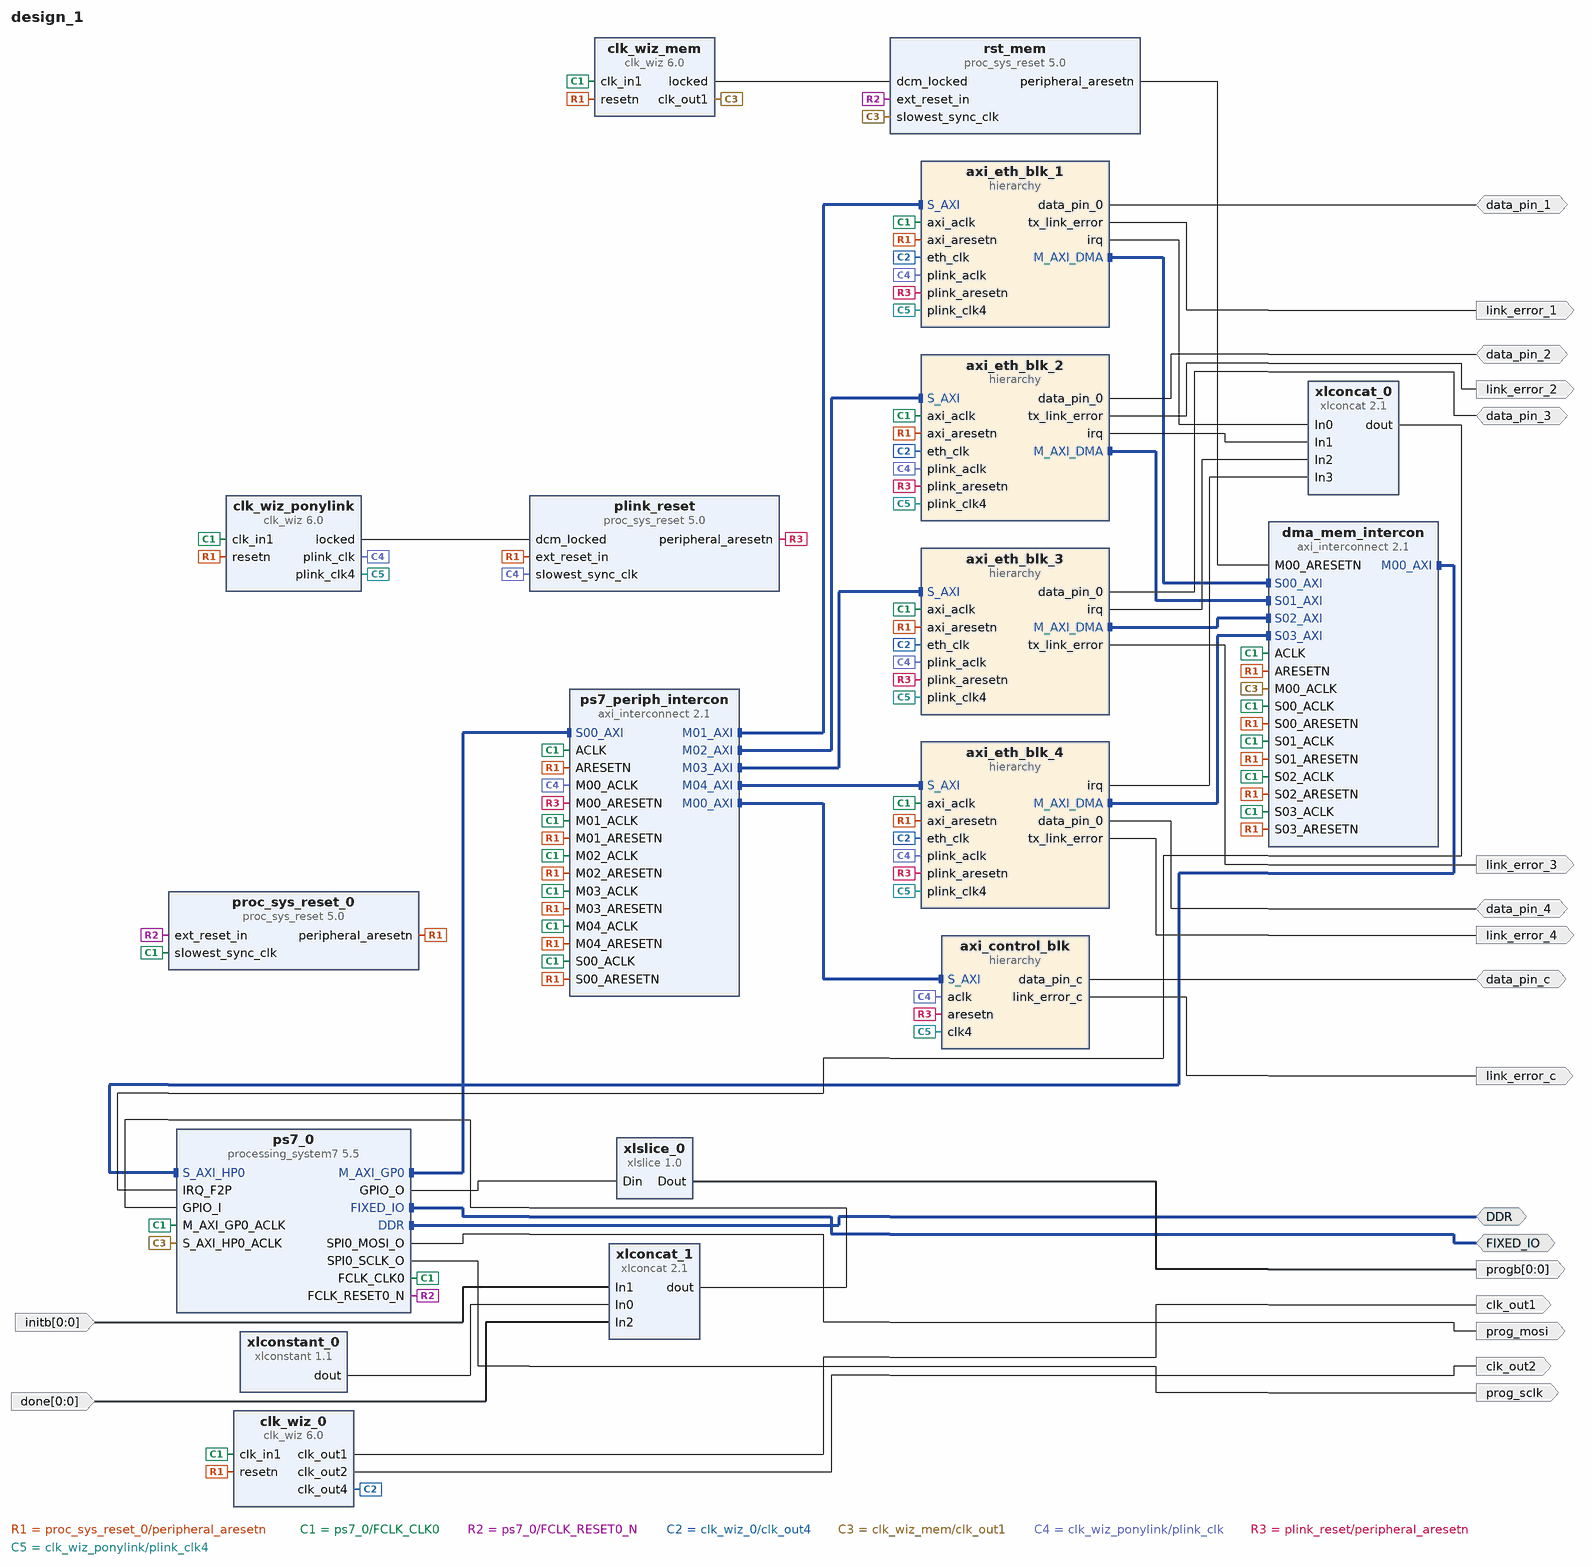
[diagram p0: block diagram of the top level]
# Vivado block design design_1, xc7z020clg484-1, Vivado 2019.2
create_bd_design design_1

create_bd_intf_port -mode Master -vlnv xilinx.com:interface:ddrx_rtl:1.0 DDR
create_bd_intf_port -mode Master -vlnv xilinx.com:display_processing_system7:fixedio_rtl:1.0 FIXED_IO
create_bd_port -dir O -type clk clk_out1
create_bd_port -dir O -type clk clk_out2
create_bd_port -dir IO data_pin_1
create_bd_port -dir O link_error_1
create_bd_port -dir IO data_pin_3
create_bd_port -dir IO data_pin_2
create_bd_port -dir O link_error_4
create_bd_port -dir O link_error_3
create_bd_port -dir O link_error_2
create_bd_port -dir IO data_pin_4
create_bd_port -dir IO data_pin_c
create_bd_port -dir O link_error_c
create_bd_port -dir O prog_mosi
create_bd_port -dir O prog_sclk
create_bd_port -dir I -from 0 -to 0 initb
create_bd_port -dir I -from 0 -to 0 done
create_bd_port -dir O -from 0 -to 0 progb

create_bd_cell -type ip -vlnv xilinx.com:ip:clk_wiz:6.0 clk_wiz_0
set_property -dict [list \
  CONFIG.AXI_DRP false \
  CONFIG.CLKIN1_JITTER_PS 200.0 \
  CONFIG.CLKOUT1_DRIVES BUFG \
  CONFIG.CLKOUT1_JITTER 192.113 \
  CONFIG.CLKOUT1_PHASE_ERROR 164.985 \
  CONFIG.CLKOUT1_REQUESTED_OUT_FREQ 50 \
  CONFIG.CLKOUT2_DRIVES BUFG \
  CONFIG.CLKOUT2_JITTER 280.027 \
  CONFIG.CLKOUT2_PHASE_ERROR 164.985 \
  CONFIG.CLKOUT2_REQUESTED_OUT_FREQ 11.0592 \
  CONFIG.CLKOUT2_USED true \
  CONFIG.CLKOUT3_DRIVES BUFG \
  CONFIG.CLKOUT3_JITTER 142.107 \
  CONFIG.CLKOUT3_PHASE_ERROR 164.985 \
  CONFIG.CLKOUT3_REQUESTED_OUT_FREQ 200 \
  CONFIG.CLKOUT3_USED true \
  CONFIG.CLKOUT4_DRIVES BUFG \
  CONFIG.CLKOUT4_REQUESTED_OUT_FREQ 125 \
  CONFIG.CLKOUT4_USED true \
  CONFIG.CLKOUT5_DRIVES BUFG \
  CONFIG.CLKOUT6_DRIVES BUFG \
  CONFIG.CLKOUT7_DRIVES BUFG \
  CONFIG.FEEDBACK_SOURCE FDBK_AUTO \
  CONFIG.MMCM_CLKFBOUT_MULT_F 20.000 \
  CONFIG.MMCM_CLKIN1_PERIOD 20.000 \
  CONFIG.MMCM_CLKIN2_PERIOD 10.0 \
  CONFIG.MMCM_CLKOUT0_DIVIDE_F 20.000 \
  CONFIG.MMCM_CLKOUT1_DIVIDE 90 \
  CONFIG.MMCM_CLKOUT2_DIVIDE 5 \
  CONFIG.MMCM_COMPENSATION ZHOLD \
  CONFIG.MMCM_DIVCLK_DIVIDE 1 \
  CONFIG.NUM_OUT_CLKS 4 \
  CONFIG.PHASE_DUTY_CONFIG false \
  CONFIG.PRIMITIVE MMCM \
  CONFIG.PRIM_SOURCE Global_buffer \
  CONFIG.RESET_PORT resetn \
  CONFIG.RESET_TYPE ACTIVE_LOW \
  CONFIG.USE_DYN_RECONFIG false \
  CONFIG.USE_LOCKED false \
  CONFIG.USE_SAFE_CLOCK_STARTUP false \
] [get_bd_cells clk_wiz_0]
create_bd_cell -type ip -vlnv xilinx.com:ip:proc_sys_reset:5.0 proc_sys_reset_0
create_bd_cell -type ip -vlnv xilinx.com:ip:processing_system7:5.5 ps7_0
set_property -dict [list \
  CONFIG.PCW_APU_PERIPHERAL_FREQMHZ 666.666666 \
  CONFIG.PCW_ENET0_ENET0_IO {MIO 16 .. 27} \
  CONFIG.PCW_ENET0_GRP_MDIO_ENABLE 1 \
  CONFIG.PCW_ENET0_GRP_MDIO_IO {MIO 52 .. 53} \
  CONFIG.PCW_ENET0_PERIPHERAL_ENABLE 1 \
  CONFIG.PCW_ENET0_RESET_ENABLE 0 \
  CONFIG.PCW_ENET_RESET_ENABLE 1 \
  CONFIG.PCW_ENET_RESET_SELECT {Share reset pin} \
  CONFIG.PCW_FPGA0_PERIPHERAL_FREQMHZ 50 \
  CONFIG.PCW_FPGA1_PERIPHERAL_FREQMHZ 100 \
  CONFIG.PCW_FPGA2_PERIPHERAL_FREQMHZ 200 \
  CONFIG.PCW_FPGA3_PERIPHERAL_FREQMHZ 10 \
  CONFIG.PCW_GP0_EN_MODIFIABLE_TXN 0 \
  CONFIG.PCW_GP1_EN_MODIFIABLE_TXN 0 \
  CONFIG.PCW_GPIO_EMIO_GPIO_ENABLE 1 \
  CONFIG.PCW_GPIO_EMIO_GPIO_IO 3 \
  CONFIG.PCW_GPIO_EMIO_GPIO_WIDTH 3 \
  CONFIG.PCW_GPIO_MIO_GPIO_ENABLE 1 \
  CONFIG.PCW_GPIO_MIO_GPIO_IO MIO \
  CONFIG.PCW_I2C_RESET_ENABLE 1 \
  CONFIG.PCW_IRQ_F2P_INTR 1 \
  CONFIG.PCW_M_AXI_GP0_FREQMHZ 50 \
  CONFIG.PCW_PERIPHERAL_BOARD_PRESET None \
  CONFIG.PCW_PRESET_BANK1_VOLTAGE {LVCMOS 2.5V} \
  CONFIG.PCW_QSPI_GRP_SINGLE_SS_ENABLE 1 \
  CONFIG.PCW_QSPI_GRP_SINGLE_SS_IO {MIO 1 .. 6} \
  CONFIG.PCW_QSPI_PERIPHERAL_ENABLE 1 \
  CONFIG.PCW_QSPI_QSPI_IO {MIO 1 .. 6} \
  CONFIG.PCW_SD0_GRP_CD_ENABLE 1 \
  CONFIG.PCW_SD0_GRP_CD_IO {MIO 48} \
  CONFIG.PCW_SD0_GRP_WP_ENABLE 0 \
  CONFIG.PCW_SD0_PERIPHERAL_ENABLE 1 \
  CONFIG.PCW_SD0_SD0_IO {MIO 40 .. 45} \
  CONFIG.PCW_SDIO_PERIPHERAL_FREQMHZ 50 \
  CONFIG.PCW_SINGLE_QSPI_DATA_MODE x4 \
  CONFIG.PCW_SPI0_PERIPHERAL_ENABLE 1 \
  CONFIG.PCW_SPI0_SPI0_IO EMIO \
  CONFIG.PCW_SPI_PERIPHERAL_FREQMHZ 166.666672 \
  CONFIG.PCW_S_AXI_HP0_FREQMHZ 100 \
  CONFIG.PCW_UART0_PERIPHERAL_ENABLE 1 \
  CONFIG.PCW_UART0_UART0_IO {MIO 46 .. 47} \
  CONFIG.PCW_UART1_PERIPHERAL_ENABLE 0 \
  CONFIG.PCW_UART_PERIPHERAL_FREQMHZ 100 \
  CONFIG.PCW_UIPARAM_DDR_BUS_WIDTH {16 Bit} \
  CONFIG.PCW_UIPARAM_DDR_FREQ_MHZ 533.333333 \
  CONFIG.PCW_UIPARAM_DDR_MEMORY_TYPE {DDR 3 (Low Voltage)} \
  CONFIG.PCW_UIPARAM_DDR_PARTNO {MT41K256M16 RE-125} \
  CONFIG.PCW_USB0_PERIPHERAL_ENABLE 1 \
  CONFIG.PCW_USB0_RESET_ENABLE 1 \
  CONFIG.PCW_USB0_RESET_IO {MIO 49} \
  CONFIG.PCW_USB0_USB0_IO {MIO 28 .. 39} \
  CONFIG.PCW_USB_RESET_ENABLE 1 \
  CONFIG.PCW_USB_RESET_SELECT {Share reset pin} \
  CONFIG.PCW_USE_FABRIC_INTERRUPT 1 \
  CONFIG.PCW_USE_S_AXI_HP0 1 \
] [get_bd_cells ps7_0]
# 509 more settings of ps7_0 are not shown: defaults, MIO pin electricals, DDR timing, and values the tool derives
create_bd_cell -type ip -vlnv xilinx.com:ip:clk_wiz:6.0 clk_wiz_mem
set_property -dict {CONFIG.RESET_PORT resetn CONFIG.RESET_TYPE ACTIVE_LOW} [get_bd_cells clk_wiz_mem]
create_bd_cell -type ip -vlnv xilinx.com:ip:proc_sys_reset:5.0 rst_mem
create_bd_cell -type hier axi_eth_blk_1
create_bd_cell -type ip -vlnv xilinx.com:ip:clk_wiz:6.0 clk_wiz_ponylink
set_property -dict [list \
  CONFIG.CLKOUT1_JITTER 236.428 \
  CONFIG.CLKOUT1_PHASE_ERROR 164.985 \
  CONFIG.CLKOUT1_REQUESTED_OUT_FREQ 25 \
  CONFIG.CLKOUT2_JITTER 162.035 \
  CONFIG.CLKOUT2_PHASE_ERROR 164.985 \
  CONFIG.CLKOUT2_REQUESTED_OUT_FREQ 100 \
  CONFIG.CLKOUT2_USED true \
  CONFIG.CLK_OUT1_PORT plink_clk \
  CONFIG.CLK_OUT2_PORT plink_clk4 \
  CONFIG.MMCM_CLKFBOUT_MULT_F 20.000 \
  CONFIG.MMCM_CLKOUT0_DIVIDE_F 40.000 \
  CONFIG.MMCM_CLKOUT1_DIVIDE 10 \
  CONFIG.NUM_OUT_CLKS 2 \
  CONFIG.RESET_PORT resetn \
  CONFIG.RESET_TYPE ACTIVE_LOW \
] [get_bd_cells clk_wiz_ponylink]
create_bd_cell -type ip -vlnv xilinx.com:ip:proc_sys_reset:5.0 plink_reset
create_bd_cell -type ip -vlnv xilinx.com:ip:xlconcat:2.1 xlconcat_0
set_property -dict [list \
  CONFIG.IN0_WIDTH 4 \
  CONFIG.IN1_WIDTH 4 \
  CONFIG.IN2_WIDTH 4 \
  CONFIG.IN3_WIDTH 4 \
  CONFIG.NUM_PORTS 4 \
] [get_bd_cells xlconcat_0]
create_bd_cell -type hier axi_control_blk
create_bd_cell -type ip -vlnv xilinx.com:ip:xlslice:1.0 xlslice_0
set_property -dict {CONFIG.DIN_WIDTH 3} [get_bd_cells xlslice_0]
create_bd_cell -type ip -vlnv xilinx.com:ip:xlconstant:1.1 xlconstant_0
set_property -dict {CONFIG.CONST_VAL 0} [get_bd_cells xlconstant_0]
create_bd_cell -type ip -vlnv xilinx.com:ip:xlconcat:2.1 xlconcat_1
set_property -dict {CONFIG.NUM_PORTS 3} [get_bd_cells xlconcat_1]
create_bd_cell -type ip -vlnv xilinx.com:ip:axi_interconnect:2.1 ps7_periph_intercon
set_property -dict {CONFIG.NUM_MI 5} [get_bd_cells ps7_periph_intercon]
create_bd_cell -type ip -vlnv xilinx.com:ip:axi_interconnect:2.1 dma_mem_intercon
set_property -dict {CONFIG.NUM_MI 1 CONFIG.NUM_SI 4} [get_bd_cells dma_mem_intercon]
create_bd_cell -type hier axi_eth_blk_2
create_bd_cell -type hier axi_eth_blk_3
create_bd_cell -type hier axi_eth_blk_4

# ---- hierarchy /axi_eth_blk_1 ----
current_bd_instance /axi_eth_blk_1
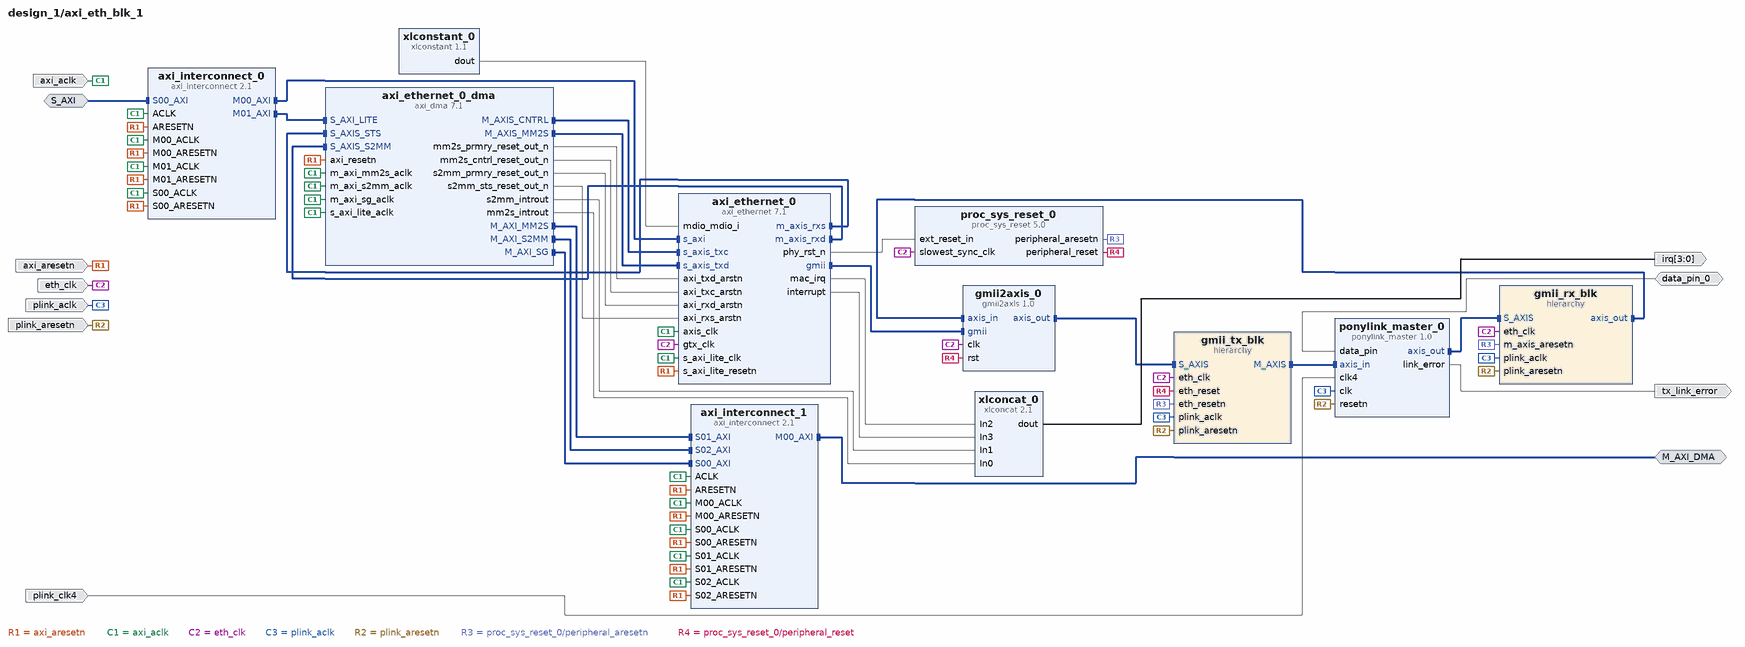
[diagram p1: block diagram inside /axi_eth_blk_1]
create_bd_intf_pin -mode Slave -vlnv xilinx.com:interface:aximm_rtl:1.0 S_AXI
create_bd_intf_pin -mode Master -vlnv xilinx.com:interface:aximm_rtl:1.0 M_AXI_DMA
create_bd_pin -dir I -type rst axi_aresetn
create_bd_pin -dir I -type clk axi_aclk
create_bd_pin -dir I -type clk eth_clk
create_bd_pin -dir O -from 3 -to 0 irq
create_bd_pin -dir I -type clk plink_aclk
create_bd_pin -dir I -type rst plink_aresetn
create_bd_pin -dir I -type clk plink_clk4
create_bd_pin -dir IO data_pin_0
create_bd_pin -dir O tx_link_error

create_bd_cell -type ip -vlnv xilinx.com:ip:axi_ethernet:7.1 axi_ethernet_0
set_property -dict {CONFIG.Include_IO false} [get_bd_cells axi_ethernet_0]
create_bd_cell -type ip -vlnv xilinx.com:ip:axi_dma:7.1 axi_ethernet_0_dma
set_property -dict [list \
  CONFIG.c_include_mm2s_dre 1 \
  CONFIG.c_include_s2mm_dre 1 \
  CONFIG.c_sg_length_width 16 \
  CONFIG.c_sg_use_stsapp_length 1 \
] [get_bd_cells axi_ethernet_0_dma]
create_bd_cell -type ip -vlnv xilinx.com:ip:xlconcat:2.1 xlconcat_0
set_property -dict {CONFIG.NUM_PORTS 4} [get_bd_cells xlconcat_0]
create_bd_cell -type hier gmii_tx_blk
create_bd_cell -type ip -vlnv xilinx.com:ip:proc_sys_reset:5.0 proc_sys_reset_0
create_bd_cell -type ip -vlnv clifford.at:cliffordwolf:ponylink_master:1.0 ponylink_master_0
set_property -dict [list \
  CONFIG.MASTER_TIMINGS 0x09070503010907050301 \
  CONFIG.SLAVE_TIMINGS 0x0d0a0705020b09060301 \
  CONFIG.TDATA_WIDTH 8 \
] [get_bd_cells ponylink_master_0]
create_bd_cell -type ip -vlnv xilinx.com:ip:xlconstant:1.1 xlconstant_0
create_bd_cell -type ip -vlnv xilinx.com:ip:axi_interconnect:2.1 axi_interconnect_0
set_property -dict {CONFIG.NUM_MI 2} [get_bd_cells axi_interconnect_0]
create_bd_cell -type ip -vlnv xilinx.com:ip:axi_interconnect:2.1 axi_interconnect_1
set_property -dict {CONFIG.NUM_MI 1 CONFIG.NUM_SI 3} [get_bd_cells axi_interconnect_1]
create_bd_cell -type hier gmii_rx_blk
create_bd_cell -type ip -vlnv user.org:user:gmii2axis:1.0 gmii2axis_0

# ---- hierarchy /axi_eth_blk_1/gmii_tx_blk ----
current_bd_instance /axi_eth_blk_1/gmii_tx_blk
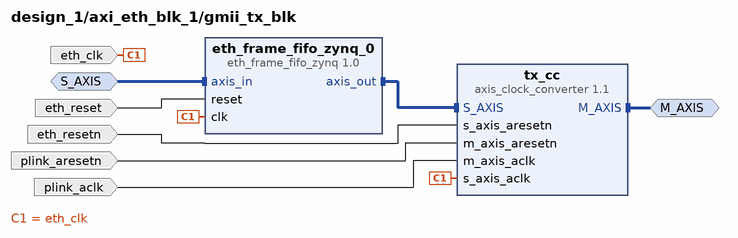
[diagram p2: block diagram inside /axi_eth_blk_1/gmii_tx_blk]
create_bd_intf_pin -mode Slave -vlnv xilinx.com:interface:axis_rtl:1.0 S_AXIS
create_bd_intf_pin -mode Master -vlnv xilinx.com:interface:axis_rtl:1.0 M_AXIS
create_bd_pin -dir I -type clk eth_clk
create_bd_pin -dir I -type rst eth_reset
create_bd_pin -dir I -type rst eth_resetn
create_bd_pin -dir I -type rst plink_aresetn
create_bd_pin -dir I -type clk plink_aclk

create_bd_cell -type ip -vlnv xilinx.com:ip:axis_clock_converter:1.1 tx_cc
create_bd_cell -type ip -vlnv user.org:user:eth_frame_fifo_zynq:1.0 eth_frame_fifo_zynq_0
set_property -dict {CONFIG.DEPTH 16384} [get_bd_cells eth_frame_fifo_zynq_0]

# ---- hierarchy /axi_eth_blk_1/gmii_rx_blk ----
current_bd_instance /axi_eth_blk_1/gmii_rx_blk
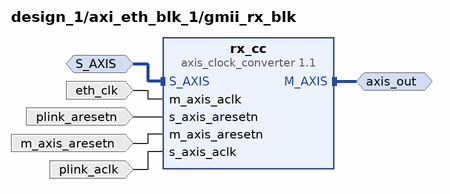
[diagram p3: block diagram inside /axi_eth_blk_1/gmii_rx_blk]
create_bd_intf_pin -mode Master -vlnv xilinx.com:interface:axis_rtl:1.0 axis_out
create_bd_intf_pin -mode Slave -vlnv xilinx.com:interface:axis_rtl:1.0 S_AXIS
create_bd_pin -dir I -type clk eth_clk
create_bd_pin -dir I -type rst plink_aresetn
create_bd_pin -dir I -type rst m_axis_aresetn
create_bd_pin -dir I -type clk plink_aclk

create_bd_cell -type ip -vlnv xilinx.com:ip:axis_clock_converter:1.1 rx_cc

# ---- hierarchy /axi_control_blk ----
current_bd_instance /axi_control_blk
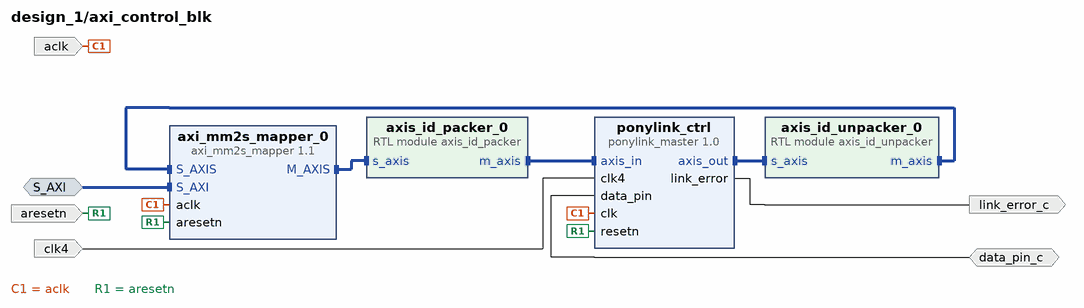
[diagram p4: block diagram inside /axi_control_blk]
create_bd_intf_pin -mode Slave -vlnv xilinx.com:interface:aximm_rtl:1.0 S_AXI
create_bd_pin -dir I -type clk aclk
create_bd_pin -dir I -type clk clk4
create_bd_pin -dir I -type rst aresetn
create_bd_pin -dir O link_error_c
create_bd_pin -dir IO data_pin_c

create_bd_cell -type ip -vlnv clifford.at:cliffordwolf:ponylink_master:1.0 ponylink_ctrl
set_property -dict [list \
  CONFIG.MASTER_TIMINGS 0x09070503010907050301 \
  CONFIG.SLAVE_TIMINGS 0x0d0a0705020b09060301 \
  CONFIG.TDATA_WIDTH 8 \
  CONFIG.TUSER_WIDTH 4 \
] [get_bd_cells ponylink_ctrl]
create_bd_cell -type module -reference axis_id_packer axis_id_packer_0
set_property -dict {CONFIG.TID_WIDTH 3 CONFIG.TUSER_WIDTH 4} [get_bd_cells axis_id_packer_0]
create_bd_cell -type module -reference axis_id_unpacker axis_id_unpacker_0
set_property -dict {CONFIG.TID_WIDTH 3 CONFIG.TUSER_WIDTH 4} [get_bd_cells axis_id_unpacker_0]
create_bd_cell -type ip -vlnv xilinx.com:ip:axi_mm2s_mapper:1.1 axi_mm2s_mapper_0
set_property -dict {CONFIG.ID_WIDTH 12 CONFIG.INTERFACES S_AXI} [get_bd_cells axi_mm2s_mapper_0]

# ---- hierarchy /axi_eth_blk_2 ----
current_bd_instance /axi_eth_blk_2
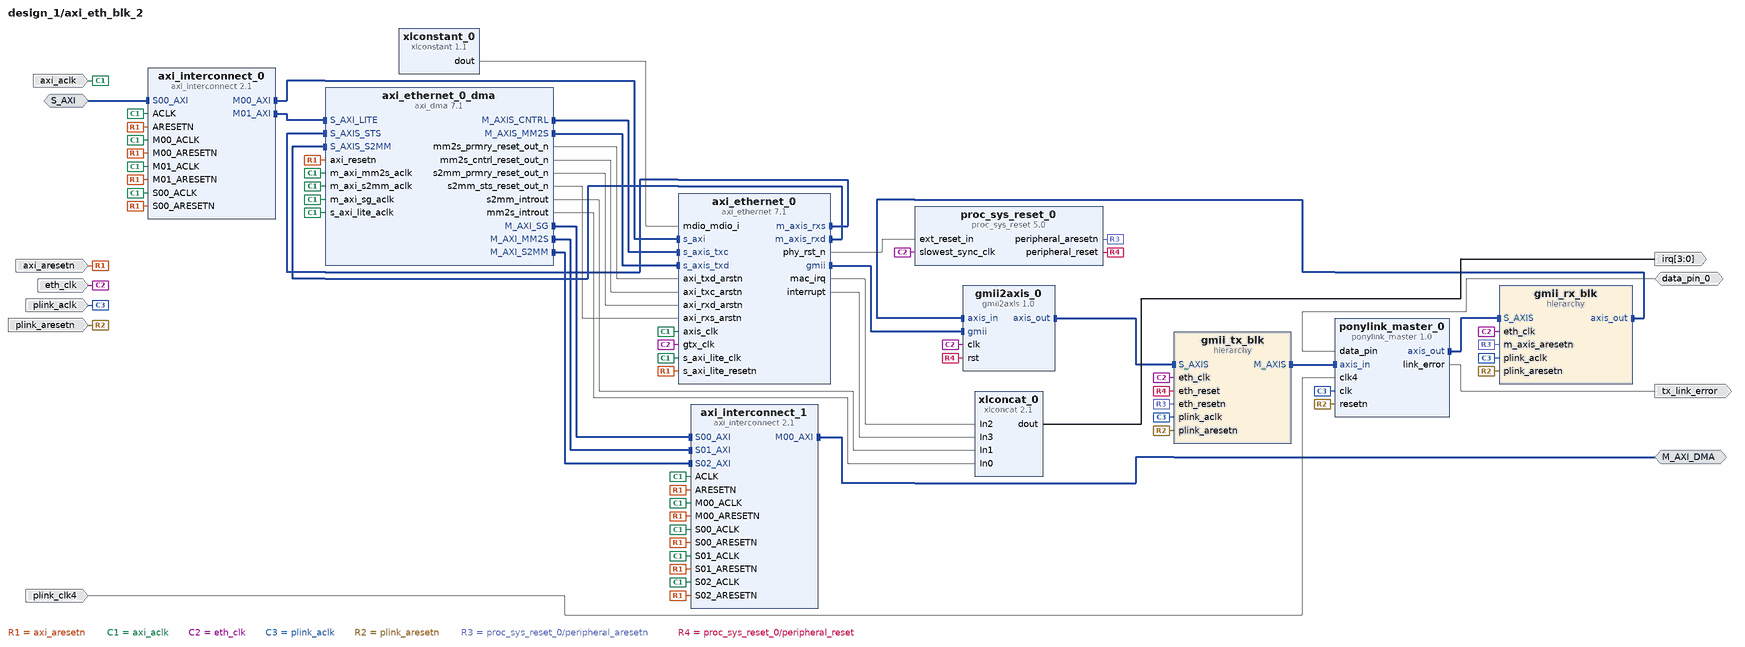
[diagram p5: block diagram inside /axi_eth_blk_2]
create_bd_intf_pin -mode Slave -vlnv xilinx.com:interface:aximm_rtl:1.0 S_AXI
create_bd_intf_pin -mode Master -vlnv xilinx.com:interface:aximm_rtl:1.0 M_AXI_DMA
create_bd_pin -dir I -type rst axi_aresetn
create_bd_pin -dir I -type clk axi_aclk
create_bd_pin -dir I -type clk eth_clk
create_bd_pin -dir O -from 3 -to 0 irq
create_bd_pin -dir I -type clk plink_aclk
create_bd_pin -dir I -type rst plink_aresetn
create_bd_pin -dir I -type clk plink_clk4
create_bd_pin -dir IO data_pin_0
create_bd_pin -dir O tx_link_error

create_bd_cell -type ip -vlnv xilinx.com:ip:axi_ethernet:7.1 axi_ethernet_0
set_property -dict {CONFIG.Include_IO false} [get_bd_cells axi_ethernet_0]
create_bd_cell -type ip -vlnv xilinx.com:ip:axi_dma:7.1 axi_ethernet_0_dma
set_property -dict [list \
  CONFIG.c_include_mm2s_dre 1 \
  CONFIG.c_include_s2mm_dre 1 \
  CONFIG.c_sg_length_width 16 \
  CONFIG.c_sg_use_stsapp_length 1 \
] [get_bd_cells axi_ethernet_0_dma]
create_bd_cell -type ip -vlnv xilinx.com:ip:xlconcat:2.1 xlconcat_0
set_property -dict {CONFIG.NUM_PORTS 4} [get_bd_cells xlconcat_0]
create_bd_cell -type hier gmii_tx_blk
create_bd_cell -type ip -vlnv xilinx.com:ip:proc_sys_reset:5.0 proc_sys_reset_0
create_bd_cell -type ip -vlnv clifford.at:cliffordwolf:ponylink_master:1.0 ponylink_master_0
set_property -dict [list \
  CONFIG.MASTER_TIMINGS 0x09070503010907050301 \
  CONFIG.SLAVE_TIMINGS 0x0d0a0705020b09060301 \
  CONFIG.TDATA_WIDTH 8 \
] [get_bd_cells ponylink_master_0]
create_bd_cell -type ip -vlnv xilinx.com:ip:xlconstant:1.1 xlconstant_0
create_bd_cell -type ip -vlnv xilinx.com:ip:axi_interconnect:2.1 axi_interconnect_0
set_property -dict {CONFIG.NUM_MI 2} [get_bd_cells axi_interconnect_0]
create_bd_cell -type ip -vlnv xilinx.com:ip:axi_interconnect:2.1 axi_interconnect_1
set_property -dict {CONFIG.NUM_MI 1 CONFIG.NUM_SI 3} [get_bd_cells axi_interconnect_1]
create_bd_cell -type hier gmii_rx_blk
create_bd_cell -type ip -vlnv user.org:user:gmii2axis:1.0 gmii2axis_0

# ---- hierarchy /axi_eth_blk_2/gmii_tx_blk ----
current_bd_instance /axi_eth_blk_2/gmii_tx_blk
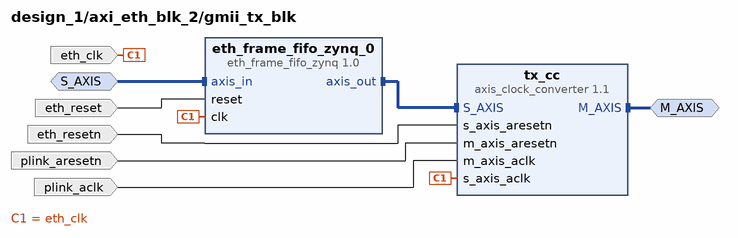
[diagram p6: block diagram inside /axi_eth_blk_2/gmii_tx_blk]
create_bd_intf_pin -mode Slave -vlnv xilinx.com:interface:axis_rtl:1.0 S_AXIS
create_bd_intf_pin -mode Master -vlnv xilinx.com:interface:axis_rtl:1.0 M_AXIS
create_bd_pin -dir I -type clk eth_clk
create_bd_pin -dir I -type rst eth_reset
create_bd_pin -dir I -type rst eth_resetn
create_bd_pin -dir I -type rst plink_aresetn
create_bd_pin -dir I -type clk plink_aclk

create_bd_cell -type ip -vlnv xilinx.com:ip:axis_clock_converter:1.1 tx_cc
create_bd_cell -type ip -vlnv user.org:user:eth_frame_fifo_zynq:1.0 eth_frame_fifo_zynq_0
set_property -dict {CONFIG.DEPTH 16384} [get_bd_cells eth_frame_fifo_zynq_0]

# ---- hierarchy /axi_eth_blk_2/gmii_rx_blk ----
current_bd_instance /axi_eth_blk_2/gmii_rx_blk
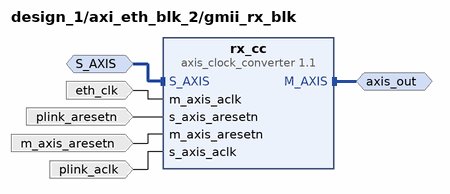
[diagram p7: block diagram inside /axi_eth_blk_2/gmii_rx_blk]
create_bd_intf_pin -mode Master -vlnv xilinx.com:interface:axis_rtl:1.0 axis_out
create_bd_intf_pin -mode Slave -vlnv xilinx.com:interface:axis_rtl:1.0 S_AXIS
create_bd_pin -dir I -type clk eth_clk
create_bd_pin -dir I -type rst plink_aresetn
create_bd_pin -dir I -type rst m_axis_aresetn
create_bd_pin -dir I -type clk plink_aclk

create_bd_cell -type ip -vlnv xilinx.com:ip:axis_clock_converter:1.1 rx_cc

# ---- hierarchy /axi_eth_blk_3 ----
current_bd_instance /axi_eth_blk_3
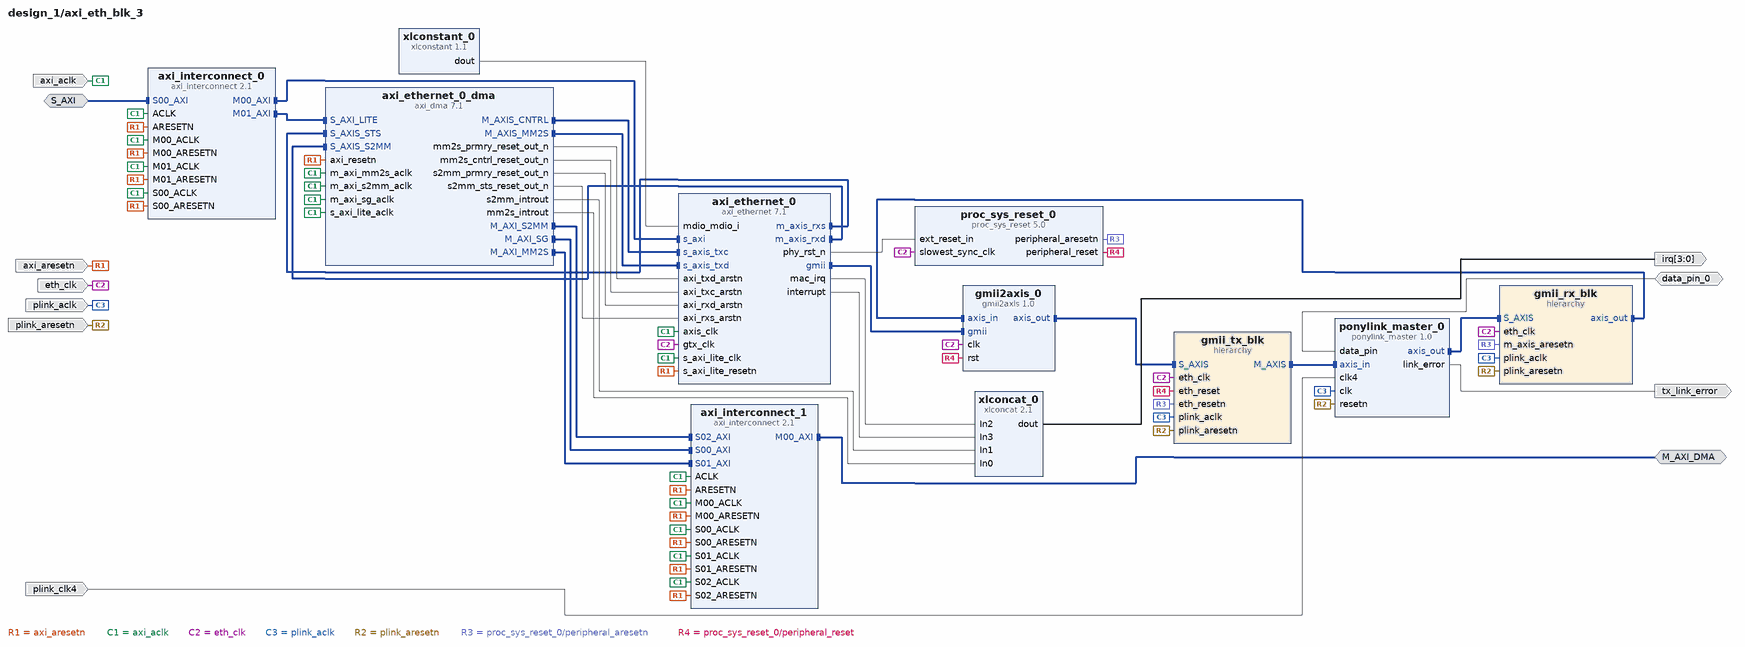
[diagram p8: block diagram inside /axi_eth_blk_3]
create_bd_intf_pin -mode Slave -vlnv xilinx.com:interface:aximm_rtl:1.0 S_AXI
create_bd_intf_pin -mode Master -vlnv xilinx.com:interface:aximm_rtl:1.0 M_AXI_DMA
create_bd_pin -dir I -type rst axi_aresetn
create_bd_pin -dir I -type clk axi_aclk
create_bd_pin -dir I -type clk eth_clk
create_bd_pin -dir O -from 3 -to 0 irq
create_bd_pin -dir I -type clk plink_aclk
create_bd_pin -dir I -type rst plink_aresetn
create_bd_pin -dir I -type clk plink_clk4
create_bd_pin -dir IO data_pin_0
create_bd_pin -dir O tx_link_error

create_bd_cell -type ip -vlnv xilinx.com:ip:axi_ethernet:7.1 axi_ethernet_0
set_property -dict {CONFIG.Include_IO false} [get_bd_cells axi_ethernet_0]
create_bd_cell -type ip -vlnv xilinx.com:ip:axi_dma:7.1 axi_ethernet_0_dma
set_property -dict [list \
  CONFIG.c_include_mm2s_dre 1 \
  CONFIG.c_include_s2mm_dre 1 \
  CONFIG.c_sg_length_width 16 \
  CONFIG.c_sg_use_stsapp_length 1 \
] [get_bd_cells axi_ethernet_0_dma]
create_bd_cell -type ip -vlnv xilinx.com:ip:xlconcat:2.1 xlconcat_0
set_property -dict {CONFIG.NUM_PORTS 4} [get_bd_cells xlconcat_0]
create_bd_cell -type hier gmii_tx_blk
create_bd_cell -type ip -vlnv xilinx.com:ip:proc_sys_reset:5.0 proc_sys_reset_0
create_bd_cell -type ip -vlnv clifford.at:cliffordwolf:ponylink_master:1.0 ponylink_master_0
set_property -dict [list \
  CONFIG.MASTER_TIMINGS 0x09070503010907050301 \
  CONFIG.SLAVE_TIMINGS 0x0d0a0705020b09060301 \
  CONFIG.TDATA_WIDTH 8 \
] [get_bd_cells ponylink_master_0]
create_bd_cell -type ip -vlnv xilinx.com:ip:xlconstant:1.1 xlconstant_0
create_bd_cell -type ip -vlnv xilinx.com:ip:axi_interconnect:2.1 axi_interconnect_0
set_property -dict {CONFIG.NUM_MI 2} [get_bd_cells axi_interconnect_0]
create_bd_cell -type ip -vlnv xilinx.com:ip:axi_interconnect:2.1 axi_interconnect_1
set_property -dict {CONFIG.NUM_MI 1 CONFIG.NUM_SI 3} [get_bd_cells axi_interconnect_1]
create_bd_cell -type hier gmii_rx_blk
create_bd_cell -type ip -vlnv user.org:user:gmii2axis:1.0 gmii2axis_0

# ---- hierarchy /axi_eth_blk_3/gmii_tx_blk ----
current_bd_instance /axi_eth_blk_3/gmii_tx_blk
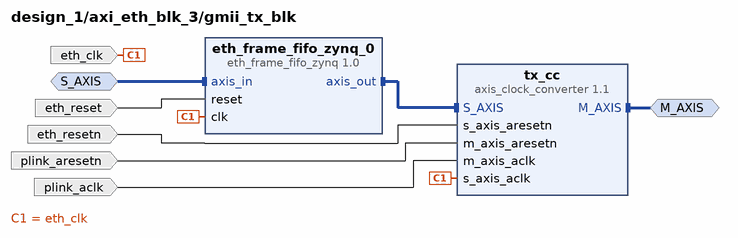
[diagram p9: block diagram inside /axi_eth_blk_3/gmii_tx_blk]
create_bd_intf_pin -mode Slave -vlnv xilinx.com:interface:axis_rtl:1.0 S_AXIS
create_bd_intf_pin -mode Master -vlnv xilinx.com:interface:axis_rtl:1.0 M_AXIS
create_bd_pin -dir I -type clk eth_clk
create_bd_pin -dir I -type rst eth_reset
create_bd_pin -dir I -type rst eth_resetn
create_bd_pin -dir I -type rst plink_aresetn
create_bd_pin -dir I -type clk plink_aclk

create_bd_cell -type ip -vlnv xilinx.com:ip:axis_clock_converter:1.1 tx_cc
create_bd_cell -type ip -vlnv user.org:user:eth_frame_fifo_zynq:1.0 eth_frame_fifo_zynq_0
set_property -dict {CONFIG.DEPTH 16384} [get_bd_cells eth_frame_fifo_zynq_0]

# ---- hierarchy /axi_eth_blk_3/gmii_rx_blk ----
current_bd_instance /axi_eth_blk_3/gmii_rx_blk
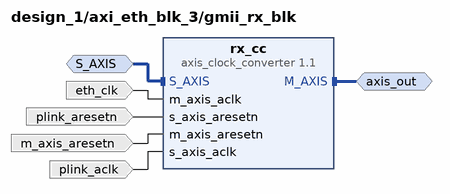
[diagram p10: block diagram inside /axi_eth_blk_3/gmii_rx_blk]
create_bd_intf_pin -mode Master -vlnv xilinx.com:interface:axis_rtl:1.0 axis_out
create_bd_intf_pin -mode Slave -vlnv xilinx.com:interface:axis_rtl:1.0 S_AXIS
create_bd_pin -dir I -type clk eth_clk
create_bd_pin -dir I -type rst plink_aresetn
create_bd_pin -dir I -type rst m_axis_aresetn
create_bd_pin -dir I -type clk plink_aclk

create_bd_cell -type ip -vlnv xilinx.com:ip:axis_clock_converter:1.1 rx_cc

# ---- hierarchy /axi_eth_blk_4 ----
current_bd_instance /axi_eth_blk_4
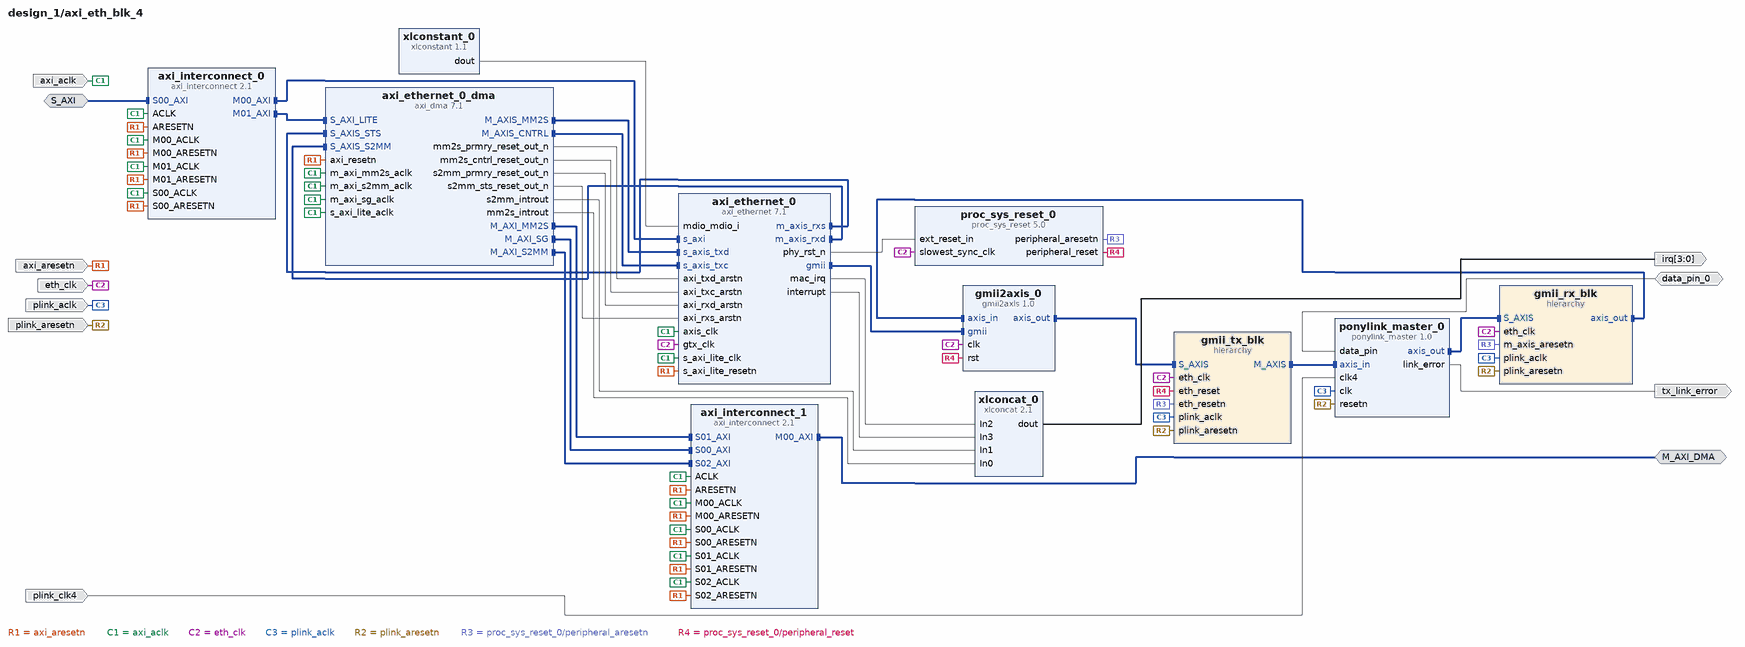
[diagram p11: block diagram inside /axi_eth_blk_4]
create_bd_intf_pin -mode Slave -vlnv xilinx.com:interface:aximm_rtl:1.0 S_AXI
create_bd_intf_pin -mode Master -vlnv xilinx.com:interface:aximm_rtl:1.0 M_AXI_DMA
create_bd_pin -dir I -type rst axi_aresetn
create_bd_pin -dir I -type clk axi_aclk
create_bd_pin -dir I -type clk eth_clk
create_bd_pin -dir O -from 3 -to 0 irq
create_bd_pin -dir I -type clk plink_aclk
create_bd_pin -dir I -type rst plink_aresetn
create_bd_pin -dir I -type clk plink_clk4
create_bd_pin -dir IO data_pin_0
create_bd_pin -dir O tx_link_error

create_bd_cell -type ip -vlnv xilinx.com:ip:axi_ethernet:7.1 axi_ethernet_0
set_property -dict {CONFIG.Include_IO false} [get_bd_cells axi_ethernet_0]
create_bd_cell -type ip -vlnv xilinx.com:ip:axi_dma:7.1 axi_ethernet_0_dma
set_property -dict [list \
  CONFIG.c_include_mm2s_dre 1 \
  CONFIG.c_include_s2mm_dre 1 \
  CONFIG.c_sg_length_width 16 \
  CONFIG.c_sg_use_stsapp_length 1 \
] [get_bd_cells axi_ethernet_0_dma]
create_bd_cell -type ip -vlnv xilinx.com:ip:xlconcat:2.1 xlconcat_0
set_property -dict {CONFIG.NUM_PORTS 4} [get_bd_cells xlconcat_0]
create_bd_cell -type hier gmii_tx_blk
create_bd_cell -type ip -vlnv xilinx.com:ip:proc_sys_reset:5.0 proc_sys_reset_0
create_bd_cell -type ip -vlnv clifford.at:cliffordwolf:ponylink_master:1.0 ponylink_master_0
set_property -dict [list \
  CONFIG.MASTER_TIMINGS 0x09070503010907050301 \
  CONFIG.SLAVE_TIMINGS 0x0d0a0705020b09060301 \
  CONFIG.TDATA_WIDTH 8 \
] [get_bd_cells ponylink_master_0]
create_bd_cell -type ip -vlnv xilinx.com:ip:xlconstant:1.1 xlconstant_0
create_bd_cell -type ip -vlnv xilinx.com:ip:axi_interconnect:2.1 axi_interconnect_0
set_property -dict {CONFIG.NUM_MI 2} [get_bd_cells axi_interconnect_0]
create_bd_cell -type ip -vlnv xilinx.com:ip:axi_interconnect:2.1 axi_interconnect_1
set_property -dict {CONFIG.NUM_MI 1 CONFIG.NUM_SI 3} [get_bd_cells axi_interconnect_1]
create_bd_cell -type hier gmii_rx_blk
create_bd_cell -type ip -vlnv user.org:user:gmii2axis:1.0 gmii2axis_0

# ---- hierarchy /axi_eth_blk_4/gmii_tx_blk ----
current_bd_instance /axi_eth_blk_4/gmii_tx_blk
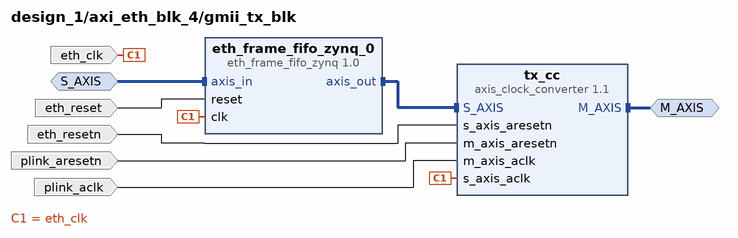
[diagram p12: block diagram inside /axi_eth_blk_4/gmii_tx_blk]
create_bd_intf_pin -mode Slave -vlnv xilinx.com:interface:axis_rtl:1.0 S_AXIS
create_bd_intf_pin -mode Master -vlnv xilinx.com:interface:axis_rtl:1.0 M_AXIS
create_bd_pin -dir I -type clk eth_clk
create_bd_pin -dir I -type rst eth_reset
create_bd_pin -dir I -type rst eth_resetn
create_bd_pin -dir I -type rst plink_aresetn
create_bd_pin -dir I -type clk plink_aclk

create_bd_cell -type ip -vlnv xilinx.com:ip:axis_clock_converter:1.1 tx_cc
create_bd_cell -type ip -vlnv user.org:user:eth_frame_fifo_zynq:1.0 eth_frame_fifo_zynq_0
set_property -dict {CONFIG.DEPTH 16384} [get_bd_cells eth_frame_fifo_zynq_0]

# ---- hierarchy /axi_eth_blk_4/gmii_rx_blk ----
current_bd_instance /axi_eth_blk_4/gmii_rx_blk
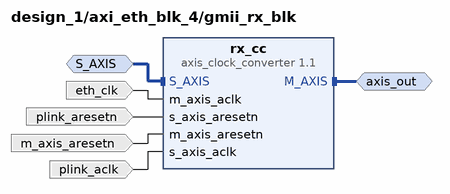
[diagram p13: block diagram inside /axi_eth_blk_4/gmii_rx_blk]
create_bd_intf_pin -mode Master -vlnv xilinx.com:interface:axis_rtl:1.0 axis_out
create_bd_intf_pin -mode Slave -vlnv xilinx.com:interface:axis_rtl:1.0 S_AXIS
create_bd_pin -dir I -type clk eth_clk
create_bd_pin -dir I -type rst plink_aresetn
create_bd_pin -dir I -type rst m_axis_aresetn
create_bd_pin -dir I -type clk plink_aclk

create_bd_cell -type ip -vlnv xilinx.com:ip:axis_clock_converter:1.1 rx_cc

# ---- connections ----

current_bd_instance /axi_eth_blk_1
connect_bd_intf_net [get_bd_intf_pins M_AXI_DMA] [get_bd_intf_pins axi_interconnect_1/M00_AXI]
connect_bd_intf_net [get_bd_intf_pins gmii2axis_0/axis_in] [get_bd_intf_pins gmii_rx_blk/axis_out]
connect_bd_intf_net [get_bd_intf_pins S_AXI] [get_bd_intf_pins axi_interconnect_0/S00_AXI]
connect_bd_intf_net [get_bd_intf_pins axi_ethernet_0_dma/M_AXIS_CNTRL] [get_bd_intf_pins axi_ethernet_0/s_axis_txc]
connect_bd_intf_net [get_bd_intf_pins axi_ethernet_0_dma/S_AXIS_STS] [get_bd_intf_pins axi_ethernet_0/m_axis_rxs]
connect_bd_intf_net [get_bd_intf_pins axi_interconnect_1/S01_AXI] [get_bd_intf_pins axi_ethernet_0_dma/M_AXI_MM2S]
connect_bd_intf_net [get_bd_intf_pins axi_ethernet_0_dma/M_AXIS_MM2S] [get_bd_intf_pins axi_ethernet_0/s_axis_txd]
connect_bd_intf_net [get_bd_intf_pins axi_ethernet_0_dma/M_AXI_S2MM] [get_bd_intf_pins axi_interconnect_1/S02_AXI]
connect_bd_intf_net [get_bd_intf_pins axi_ethernet_0_dma/M_AXI_SG] [get_bd_intf_pins axi_interconnect_1/S00_AXI]
connect_bd_intf_net [get_bd_intf_pins axi_interconnect_0/M01_AXI] [get_bd_intf_pins axi_ethernet_0_dma/S_AXI_LITE]
connect_bd_intf_net [get_bd_intf_pins gmii2axis_0/gmii] [get_bd_intf_pins axi_ethernet_0/gmii]
connect_bd_intf_net [get_bd_intf_pins gmii_rx_blk/S_AXIS] [get_bd_intf_pins ponylink_master_0/axis_out]
connect_bd_intf_net [get_bd_intf_pins axi_ethernet_0_dma/S_AXIS_S2MM] [get_bd_intf_pins axi_ethernet_0/m_axis_rxd]
connect_bd_intf_net [get_bd_intf_pins gmii_tx_blk/M_AXIS] [get_bd_intf_pins ponylink_master_0/axis_in]
connect_bd_intf_net [get_bd_intf_pins gmii_tx_blk/S_AXIS] [get_bd_intf_pins gmii2axis_0/axis_out]
connect_bd_intf_net [get_bd_intf_pins axi_interconnect_0/M00_AXI] [get_bd_intf_pins axi_ethernet_0/s_axi]
connect_bd_net [get_bd_pins axi_ethernet_0_dma/mm2s_prmry_reset_out_n] [get_bd_pins axi_ethernet_0/axi_txd_arstn]
connect_bd_net [get_bd_pins axi_ethernet_0_dma/mm2s_cntrl_reset_out_n] [get_bd_pins axi_ethernet_0/axi_txc_arstn]
connect_bd_net [get_bd_pins axi_ethernet_0_dma/s2mm_prmry_reset_out_n] [get_bd_pins axi_ethernet_0/axi_rxd_arstn]
connect_bd_net [get_bd_pins axi_ethernet_0_dma/s2mm_sts_reset_out_n] [get_bd_pins axi_ethernet_0/axi_rxs_arstn]
connect_bd_net -net proc_sys_reset_0_peripheral_aresetn [get_bd_pins axi_aresetn] \
  [get_bd_pins axi_ethernet_0_dma/axi_resetn] [get_bd_pins axi_ethernet_0/s_axi_lite_resetn] \
  [get_bd_pins axi_interconnect_0/ARESETN] [get_bd_pins axi_interconnect_0/S00_ARESETN] \
  [get_bd_pins axi_interconnect_0/M00_ARESETN] [get_bd_pins axi_interconnect_0/M01_ARESETN] \
  [get_bd_pins axi_interconnect_1/ARESETN] [get_bd_pins axi_interconnect_1/S00_ARESETN] \
  [get_bd_pins axi_interconnect_1/S01_ARESETN] [get_bd_pins axi_interconnect_1/S02_ARESETN] \
  [get_bd_pins axi_interconnect_1/M00_ARESETN]
connect_bd_net -net processing_system7_0_FCLK_CLK0 [get_bd_pins axi_aclk] \
  [get_bd_pins axi_ethernet_0_dma/m_axi_mm2s_aclk] [get_bd_pins axi_ethernet_0_dma/m_axi_s2mm_aclk] \
  [get_bd_pins axi_ethernet_0/axis_clk] [get_bd_pins axi_ethernet_0_dma/s_axi_lite_aclk] \
  [get_bd_pins axi_ethernet_0_dma/m_axi_sg_aclk] [get_bd_pins axi_ethernet_0/s_axi_lite_clk] \
  [get_bd_pins axi_interconnect_0/ACLK] [get_bd_pins axi_interconnect_0/S00_ACLK] [get_bd_pins axi_interconnect_0/M00_ACLK] \
  [get_bd_pins axi_interconnect_0/M01_ACLK] [get_bd_pins axi_interconnect_1/ACLK] [get_bd_pins axi_interconnect_1/S00_ACLK] \
  [get_bd_pins axi_interconnect_1/S01_ACLK] [get_bd_pins axi_interconnect_1/S02_ACLK] \
  [get_bd_pins axi_interconnect_1/M00_ACLK]
connect_bd_net -net clk_wiz_0_clk_out4 [get_bd_pins eth_clk] \
  [get_bd_pins axi_ethernet_0/gtx_clk] [get_bd_pins gmii_tx_blk/eth_clk] [get_bd_pins proc_sys_reset_0/slowest_sync_clk] \
  [get_bd_pins gmii_rx_blk/eth_clk] [get_bd_pins gmii2axis_0/clk]
connect_bd_net [get_bd_pins xlconcat_0/dout] [get_bd_pins irq]
connect_bd_net [get_bd_pins axi_ethernet_0_dma/s2mm_introut] [get_bd_pins xlconcat_0/In1]
connect_bd_net [get_bd_pins axi_ethernet_0_dma/mm2s_introut] [get_bd_pins xlconcat_0/In0]
connect_bd_net [get_bd_pins axi_ethernet_0/mac_irq] [get_bd_pins xlconcat_0/In2]
connect_bd_net [get_bd_pins axi_ethernet_0/interrupt] [get_bd_pins xlconcat_0/In3]
connect_bd_net -net m_axis_aclk_1 [get_bd_pins plink_aclk] \
  [get_bd_pins gmii_tx_blk/plink_aclk] [get_bd_pins ponylink_master_0/clk] [get_bd_pins gmii_rx_blk/plink_aclk]
connect_bd_net -net m_axis_aresetn_1 [get_bd_pins plink_aresetn] \
  [get_bd_pins gmii_tx_blk/plink_aresetn] [get_bd_pins ponylink_master_0/resetn] [get_bd_pins gmii_rx_blk/plink_aresetn]
connect_bd_net -net clk4_1 [get_bd_pins plink_clk4] [get_bd_pins ponylink_master_0/clk4]
connect_bd_net [get_bd_pins data_pin_0] [get_bd_pins ponylink_master_0/data_pin]
connect_bd_net [get_bd_pins axi_ethernet_0/phy_rst_n] [get_bd_pins proc_sys_reset_0/ext_reset_in]
connect_bd_net [get_bd_pins proc_sys_reset_0/peripheral_aresetn] [get_bd_pins gmii_tx_blk/eth_resetn] [get_bd_pins gmii_rx_blk/m_axis_aresetn]
connect_bd_net -net reset_1 [get_bd_pins proc_sys_reset_0/peripheral_reset] [get_bd_pins gmii_tx_blk/eth_reset] [get_bd_pins gmii2axis_0/rst]
connect_bd_net [get_bd_pins ponylink_master_0/link_error] [get_bd_pins tx_link_error]
connect_bd_net [get_bd_pins xlconstant_0/dout] [get_bd_pins axi_ethernet_0/mdio_mdio_i]

current_bd_instance /axi_eth_blk_1/gmii_tx_blk
connect_bd_intf_net [get_bd_intf_pins eth_frame_fifo_zynq_0/axis_out] [get_bd_intf_pins tx_cc/S_AXIS]
connect_bd_intf_net [get_bd_intf_pins S_AXIS] [get_bd_intf_pins eth_frame_fifo_zynq_0/axis_in]
connect_bd_intf_net [get_bd_intf_pins M_AXIS] [get_bd_intf_pins tx_cc/M_AXIS]
connect_bd_net -net clk_wiz_0_clk_out4 [get_bd_pins eth_clk] [get_bd_pins tx_cc/s_axis_aclk] [get_bd_pins eth_frame_fifo_zynq_0/clk]
connect_bd_net -net proc_sys_reset_0_peripheral_aresetn [get_bd_pins eth_resetn] [get_bd_pins tx_cc/s_axis_aresetn]
connect_bd_net -net m_axis_aresetn_1 [get_bd_pins plink_aresetn] [get_bd_pins tx_cc/m_axis_aresetn]
connect_bd_net -net m_axis_aclk_1 [get_bd_pins plink_aclk] [get_bd_pins tx_cc/m_axis_aclk]
connect_bd_net [get_bd_pins eth_reset] [get_bd_pins eth_frame_fifo_zynq_0/reset]

current_bd_instance /axi_eth_blk_1/gmii_rx_blk
connect_bd_intf_net [get_bd_intf_pins S_AXIS] [get_bd_intf_pins rx_cc/S_AXIS]
connect_bd_intf_net [get_bd_intf_pins axis_out] [get_bd_intf_pins rx_cc/M_AXIS]
connect_bd_net -net clk_wiz_0_clk_out4 [get_bd_pins eth_clk] [get_bd_pins rx_cc/m_axis_aclk]
connect_bd_net -net m_axis_aresetn_1 [get_bd_pins plink_aresetn] [get_bd_pins rx_cc/s_axis_aresetn]
connect_bd_net -net proc_sys_reset_0_peripheral_aresetn1 [get_bd_pins m_axis_aresetn] [get_bd_pins rx_cc/m_axis_aresetn]
connect_bd_net -net m_axis_aclk_1 [get_bd_pins plink_aclk] [get_bd_pins rx_cc/s_axis_aclk]

current_bd_instance /axi_control_blk
connect_bd_intf_net [get_bd_intf_pins S_AXI] [get_bd_intf_pins axi_mm2s_mapper_0/S_AXI]
connect_bd_intf_net [get_bd_intf_pins axis_id_unpacker_0/m_axis] [get_bd_intf_pins axi_mm2s_mapper_0/S_AXIS]
connect_bd_intf_net [get_bd_intf_pins ponylink_ctrl/axis_out] [get_bd_intf_pins axis_id_unpacker_0/s_axis]
connect_bd_intf_net [get_bd_intf_pins axi_mm2s_mapper_0/M_AXIS] [get_bd_intf_pins axis_id_packer_0/s_axis]
connect_bd_intf_net [get_bd_intf_pins axis_id_packer_0/m_axis] [get_bd_intf_pins ponylink_ctrl/axis_in]
connect_bd_net -net clk_wiz_ponylink_plink_clk [get_bd_pins aclk] [get_bd_pins axi_mm2s_mapper_0/aclk] [get_bd_pins ponylink_ctrl/clk]
connect_bd_net -net clk_wiz_ponylink_plink_clk4 [get_bd_pins clk4] [get_bd_pins ponylink_ctrl/clk4]
connect_bd_net -net plink_reset_peripheral_aresetn [get_bd_pins aresetn] [get_bd_pins axi_mm2s_mapper_0/aresetn] [get_bd_pins ponylink_ctrl/resetn]
connect_bd_net -net ponylink_master_0_link_error [get_bd_pins ponylink_ctrl/link_error] [get_bd_pins link_error_c]
connect_bd_net [get_bd_pins data_pin_c] [get_bd_pins ponylink_ctrl/data_pin]

current_bd_instance /axi_eth_blk_2
connect_bd_intf_net [get_bd_intf_pins S_AXI] [get_bd_intf_pins axi_interconnect_0/S00_AXI]
connect_bd_intf_net [get_bd_intf_pins axi_ethernet_0_dma/M_AXI_SG] [get_bd_intf_pins axi_interconnect_1/S00_AXI]
connect_bd_intf_net [get_bd_intf_pins M_AXI_DMA] [get_bd_intf_pins axi_interconnect_1/M00_AXI]
connect_bd_intf_net [get_bd_intf_pins axi_ethernet_0_dma/M_AXIS_CNTRL] [get_bd_intf_pins axi_ethernet_0/s_axis_txc]
connect_bd_intf_net [get_bd_intf_pins gmii2axis_0/axis_in] [get_bd_intf_pins gmii_rx_blk/axis_out]
connect_bd_intf_net [get_bd_intf_pins axi_ethernet_0_dma/S_AXIS_STS] [get_bd_intf_pins axi_ethernet_0/m_axis_rxs]
connect_bd_intf_net [get_bd_intf_pins axi_ethernet_0_dma/S_AXIS_S2MM] [get_bd_intf_pins axi_ethernet_0/m_axis_rxd]
connect_bd_intf_net [get_bd_intf_pins gmii_tx_blk/M_AXIS] [get_bd_intf_pins ponylink_master_0/axis_in]
connect_bd_intf_net [get_bd_intf_pins axi_ethernet_0_dma/M_AXIS_MM2S] [get_bd_intf_pins axi_ethernet_0/s_axis_txd]
connect_bd_intf_net [get_bd_intf_pins axi_interconnect_1/S01_AXI] [get_bd_intf_pins axi_ethernet_0_dma/M_AXI_MM2S]
connect_bd_intf_net [get_bd_intf_pins gmii_rx_blk/S_AXIS] [get_bd_intf_pins ponylink_master_0/axis_out]
connect_bd_intf_net [get_bd_intf_pins axi_interconnect_0/M01_AXI] [get_bd_intf_pins axi_ethernet_0_dma/S_AXI_LITE]
connect_bd_intf_net [get_bd_intf_pins axi_ethernet_0_dma/M_AXI_S2MM] [get_bd_intf_pins axi_interconnect_1/S02_AXI]
connect_bd_intf_net [get_bd_intf_pins gmii2axis_0/gmii] [get_bd_intf_pins axi_ethernet_0/gmii]
connect_bd_intf_net [get_bd_intf_pins axi_interconnect_0/M00_AXI] [get_bd_intf_pins axi_ethernet_0/s_axi]
connect_bd_intf_net [get_bd_intf_pins gmii_tx_blk/S_AXIS] [get_bd_intf_pins gmii2axis_0/axis_out]
connect_bd_net [get_bd_pins axi_ethernet_0_dma/mm2s_prmry_reset_out_n] [get_bd_pins axi_ethernet_0/axi_txd_arstn]
connect_bd_net [get_bd_pins axi_ethernet_0_dma/mm2s_cntrl_reset_out_n] [get_bd_pins axi_ethernet_0/axi_txc_arstn]
connect_bd_net [get_bd_pins axi_ethernet_0_dma/s2mm_prmry_reset_out_n] [get_bd_pins axi_ethernet_0/axi_rxd_arstn]
connect_bd_net [get_bd_pins axi_ethernet_0_dma/s2mm_sts_reset_out_n] [get_bd_pins axi_ethernet_0/axi_rxs_arstn]
connect_bd_net -net proc_sys_reset_0_peripheral_aresetn [get_bd_pins axi_aresetn] \
  [get_bd_pins axi_ethernet_0_dma/axi_resetn] [get_bd_pins axi_ethernet_0/s_axi_lite_resetn] \
  [get_bd_pins axi_interconnect_0/ARESETN] [get_bd_pins axi_interconnect_0/S00_ARESETN] \
  [get_bd_pins axi_interconnect_0/M00_ARESETN] [get_bd_pins axi_interconnect_0/M01_ARESETN] \
  [get_bd_pins axi_interconnect_1/ARESETN] [get_bd_pins axi_interconnect_1/S00_ARESETN] \
  [get_bd_pins axi_interconnect_1/S01_ARESETN] [get_bd_pins axi_interconnect_1/S02_ARESETN] \
  [get_bd_pins axi_interconnect_1/M00_ARESETN]
connect_bd_net -net processing_system7_0_FCLK_CLK0 [get_bd_pins axi_aclk] \
  [get_bd_pins axi_ethernet_0_dma/m_axi_mm2s_aclk] [get_bd_pins axi_ethernet_0_dma/m_axi_s2mm_aclk] \
  [get_bd_pins axi_ethernet_0/axis_clk] [get_bd_pins axi_ethernet_0_dma/s_axi_lite_aclk] \
  [get_bd_pins axi_ethernet_0_dma/m_axi_sg_aclk] [get_bd_pins axi_ethernet_0/s_axi_lite_clk] \
  [get_bd_pins axi_interconnect_0/ACLK] [get_bd_pins axi_interconnect_0/S00_ACLK] [get_bd_pins axi_interconnect_0/M00_ACLK] \
  [get_bd_pins axi_interconnect_0/M01_ACLK] [get_bd_pins axi_interconnect_1/ACLK] [get_bd_pins axi_interconnect_1/S00_ACLK] \
  [get_bd_pins axi_interconnect_1/S01_ACLK] [get_bd_pins axi_interconnect_1/S02_ACLK] \
  [get_bd_pins axi_interconnect_1/M00_ACLK]
connect_bd_net -net clk_wiz_0_clk_out4 [get_bd_pins eth_clk] \
  [get_bd_pins axi_ethernet_0/gtx_clk] [get_bd_pins gmii_tx_blk/eth_clk] [get_bd_pins proc_sys_reset_0/slowest_sync_clk] \
  [get_bd_pins gmii_rx_blk/eth_clk] [get_bd_pins gmii2axis_0/clk]
connect_bd_net [get_bd_pins xlconcat_0/dout] [get_bd_pins irq]
connect_bd_net [get_bd_pins axi_ethernet_0_dma/s2mm_introut] [get_bd_pins xlconcat_0/In1]
connect_bd_net [get_bd_pins axi_ethernet_0_dma/mm2s_introut] [get_bd_pins xlconcat_0/In0]
connect_bd_net [get_bd_pins axi_ethernet_0/mac_irq] [get_bd_pins xlconcat_0/In2]
connect_bd_net [get_bd_pins axi_ethernet_0/interrupt] [get_bd_pins xlconcat_0/In3]
connect_bd_net -net m_axis_aclk_1 [get_bd_pins plink_aclk] \
  [get_bd_pins gmii_tx_blk/plink_aclk] [get_bd_pins ponylink_master_0/clk] [get_bd_pins gmii_rx_blk/plink_aclk]
connect_bd_net -net m_axis_aresetn_1 [get_bd_pins plink_aresetn] \
  [get_bd_pins gmii_tx_blk/plink_aresetn] [get_bd_pins ponylink_master_0/resetn] [get_bd_pins gmii_rx_blk/plink_aresetn]
connect_bd_net -net clk4_1 [get_bd_pins plink_clk4] [get_bd_pins ponylink_master_0/clk4]
connect_bd_net [get_bd_pins data_pin_0] [get_bd_pins ponylink_master_0/data_pin]
connect_bd_net [get_bd_pins axi_ethernet_0/phy_rst_n] [get_bd_pins proc_sys_reset_0/ext_reset_in]
connect_bd_net [get_bd_pins proc_sys_reset_0/peripheral_aresetn] [get_bd_pins gmii_tx_blk/eth_resetn] [get_bd_pins gmii_rx_blk/m_axis_aresetn]
connect_bd_net -net reset_1 [get_bd_pins proc_sys_reset_0/peripheral_reset] [get_bd_pins gmii_tx_blk/eth_reset] [get_bd_pins gmii2axis_0/rst]
connect_bd_net [get_bd_pins ponylink_master_0/link_error] [get_bd_pins tx_link_error]
connect_bd_net [get_bd_pins xlconstant_0/dout] [get_bd_pins axi_ethernet_0/mdio_mdio_i]

current_bd_instance /axi_eth_blk_2/gmii_tx_blk
connect_bd_intf_net [get_bd_intf_pins S_AXIS] [get_bd_intf_pins eth_frame_fifo_zynq_0/axis_in]
connect_bd_intf_net [get_bd_intf_pins eth_frame_fifo_zynq_0/axis_out] [get_bd_intf_pins tx_cc/S_AXIS]
connect_bd_intf_net [get_bd_intf_pins M_AXIS] [get_bd_intf_pins tx_cc/M_AXIS]
connect_bd_net -net clk_wiz_0_clk_out4 [get_bd_pins eth_clk] [get_bd_pins tx_cc/s_axis_aclk] [get_bd_pins eth_frame_fifo_zynq_0/clk]
connect_bd_net -net proc_sys_reset_0_peripheral_aresetn [get_bd_pins eth_resetn] [get_bd_pins tx_cc/s_axis_aresetn]
connect_bd_net -net m_axis_aresetn_1 [get_bd_pins plink_aresetn] [get_bd_pins tx_cc/m_axis_aresetn]
connect_bd_net -net m_axis_aclk_1 [get_bd_pins plink_aclk] [get_bd_pins tx_cc/m_axis_aclk]
connect_bd_net [get_bd_pins eth_reset] [get_bd_pins eth_frame_fifo_zynq_0/reset]

current_bd_instance /axi_eth_blk_2/gmii_rx_blk
connect_bd_intf_net [get_bd_intf_pins S_AXIS] [get_bd_intf_pins rx_cc/S_AXIS]
connect_bd_intf_net [get_bd_intf_pins axis_out] [get_bd_intf_pins rx_cc/M_AXIS]
connect_bd_net -net clk_wiz_0_clk_out4 [get_bd_pins eth_clk] [get_bd_pins rx_cc/m_axis_aclk]
connect_bd_net -net m_axis_aresetn_1 [get_bd_pins plink_aresetn] [get_bd_pins rx_cc/s_axis_aresetn]
connect_bd_net -net proc_sys_reset_0_peripheral_aresetn1 [get_bd_pins m_axis_aresetn] [get_bd_pins rx_cc/m_axis_aresetn]
connect_bd_net -net m_axis_aclk_1 [get_bd_pins plink_aclk] [get_bd_pins rx_cc/s_axis_aclk]

current_bd_instance /axi_eth_blk_3
connect_bd_intf_net [get_bd_intf_pins axi_interconnect_0/M01_AXI] [get_bd_intf_pins axi_ethernet_0_dma/S_AXI_LITE]
connect_bd_intf_net [get_bd_intf_pins axi_ethernet_0_dma/M_AXI_S2MM] [get_bd_intf_pins axi_interconnect_1/S02_AXI]
connect_bd_intf_net [get_bd_intf_pins axi_ethernet_0_dma/M_AXIS_CNTRL] [get_bd_intf_pins axi_ethernet_0/s_axis_txc]
connect_bd_intf_net [get_bd_intf_pins axi_ethernet_0_dma/M_AXI_SG] [get_bd_intf_pins axi_interconnect_1/S00_AXI]
connect_bd_intf_net [get_bd_intf_pins M_AXI_DMA] [get_bd_intf_pins axi_interconnect_1/M00_AXI]
connect_bd_intf_net [get_bd_intf_pins gmii2axis_0/axis_in] [get_bd_intf_pins gmii_rx_blk/axis_out]
connect_bd_intf_net [get_bd_intf_pins gmii_rx_blk/S_AXIS] [get_bd_intf_pins ponylink_master_0/axis_out]
connect_bd_intf_net [get_bd_intf_pins axi_ethernet_0_dma/S_AXIS_STS] [get_bd_intf_pins axi_ethernet_0/m_axis_rxs]
connect_bd_intf_net [get_bd_intf_pins axi_interconnect_1/S01_AXI] [get_bd_intf_pins axi_ethernet_0_dma/M_AXI_MM2S]
connect_bd_intf_net [get_bd_intf_pins gmii_tx_blk/M_AXIS] [get_bd_intf_pins ponylink_master_0/axis_in]
connect_bd_intf_net [get_bd_intf_pins S_AXI] [get_bd_intf_pins axi_interconnect_0/S00_AXI]
connect_bd_intf_net [get_bd_intf_pins axi_ethernet_0_dma/M_AXIS_MM2S] [get_bd_intf_pins axi_ethernet_0/s_axis_txd]
connect_bd_intf_net [get_bd_intf_pins axi_ethernet_0_dma/S_AXIS_S2MM] [get_bd_intf_pins axi_ethernet_0/m_axis_rxd]
connect_bd_intf_net [get_bd_intf_pins axi_interconnect_0/M00_AXI] [get_bd_intf_pins axi_ethernet_0/s_axi]
connect_bd_intf_net [get_bd_intf_pins gmii2axis_0/gmii] [get_bd_intf_pins axi_ethernet_0/gmii]
connect_bd_intf_net [get_bd_intf_pins gmii_tx_blk/S_AXIS] [get_bd_intf_pins gmii2axis_0/axis_out]
connect_bd_net [get_bd_pins axi_ethernet_0_dma/mm2s_prmry_reset_out_n] [get_bd_pins axi_ethernet_0/axi_txd_arstn]
connect_bd_net [get_bd_pins axi_ethernet_0_dma/mm2s_cntrl_reset_out_n] [get_bd_pins axi_ethernet_0/axi_txc_arstn]
connect_bd_net [get_bd_pins axi_ethernet_0_dma/s2mm_prmry_reset_out_n] [get_bd_pins axi_ethernet_0/axi_rxd_arstn]
connect_bd_net [get_bd_pins axi_ethernet_0_dma/s2mm_sts_reset_out_n] [get_bd_pins axi_ethernet_0/axi_rxs_arstn]
connect_bd_net -net proc_sys_reset_0_peripheral_aresetn [get_bd_pins axi_aresetn] \
  [get_bd_pins axi_ethernet_0_dma/axi_resetn] [get_bd_pins axi_ethernet_0/s_axi_lite_resetn] \
  [get_bd_pins axi_interconnect_0/ARESETN] [get_bd_pins axi_interconnect_0/S00_ARESETN] \
  [get_bd_pins axi_interconnect_0/M00_ARESETN] [get_bd_pins axi_interconnect_0/M01_ARESETN] \
  [get_bd_pins axi_interconnect_1/ARESETN] [get_bd_pins axi_interconnect_1/S00_ARESETN] \
  [get_bd_pins axi_interconnect_1/S01_ARESETN] [get_bd_pins axi_interconnect_1/S02_ARESETN] \
  [get_bd_pins axi_interconnect_1/M00_ARESETN]
connect_bd_net -net processing_system7_0_FCLK_CLK0 [get_bd_pins axi_aclk] \
  [get_bd_pins axi_ethernet_0_dma/m_axi_mm2s_aclk] [get_bd_pins axi_ethernet_0_dma/m_axi_s2mm_aclk] \
  [get_bd_pins axi_ethernet_0/axis_clk] [get_bd_pins axi_ethernet_0_dma/s_axi_lite_aclk] \
  [get_bd_pins axi_ethernet_0_dma/m_axi_sg_aclk] [get_bd_pins axi_ethernet_0/s_axi_lite_clk] \
  [get_bd_pins axi_interconnect_0/ACLK] [get_bd_pins axi_interconnect_0/S00_ACLK] [get_bd_pins axi_interconnect_0/M00_ACLK] \
  [get_bd_pins axi_interconnect_0/M01_ACLK] [get_bd_pins axi_interconnect_1/ACLK] [get_bd_pins axi_interconnect_1/S00_ACLK] \
  [get_bd_pins axi_interconnect_1/S01_ACLK] [get_bd_pins axi_interconnect_1/S02_ACLK] \
  [get_bd_pins axi_interconnect_1/M00_ACLK]
connect_bd_net -net clk_wiz_0_clk_out4 [get_bd_pins eth_clk] \
  [get_bd_pins axi_ethernet_0/gtx_clk] [get_bd_pins gmii_tx_blk/eth_clk] [get_bd_pins proc_sys_reset_0/slowest_sync_clk] \
  [get_bd_pins gmii_rx_blk/eth_clk] [get_bd_pins gmii2axis_0/clk]
connect_bd_net [get_bd_pins xlconcat_0/dout] [get_bd_pins irq]
connect_bd_net [get_bd_pins axi_ethernet_0_dma/s2mm_introut] [get_bd_pins xlconcat_0/In1]
connect_bd_net [get_bd_pins axi_ethernet_0_dma/mm2s_introut] [get_bd_pins xlconcat_0/In0]
connect_bd_net [get_bd_pins axi_ethernet_0/mac_irq] [get_bd_pins xlconcat_0/In2]
connect_bd_net [get_bd_pins axi_ethernet_0/interrupt] [get_bd_pins xlconcat_0/In3]
connect_bd_net -net m_axis_aclk_1 [get_bd_pins plink_aclk] \
  [get_bd_pins gmii_tx_blk/plink_aclk] [get_bd_pins ponylink_master_0/clk] [get_bd_pins gmii_rx_blk/plink_aclk]
connect_bd_net -net m_axis_aresetn_1 [get_bd_pins plink_aresetn] \
  [get_bd_pins gmii_tx_blk/plink_aresetn] [get_bd_pins ponylink_master_0/resetn] [get_bd_pins gmii_rx_blk/plink_aresetn]
connect_bd_net -net clk4_1 [get_bd_pins plink_clk4] [get_bd_pins ponylink_master_0/clk4]
connect_bd_net [get_bd_pins data_pin_0] [get_bd_pins ponylink_master_0/data_pin]
connect_bd_net [get_bd_pins axi_ethernet_0/phy_rst_n] [get_bd_pins proc_sys_reset_0/ext_reset_in]
connect_bd_net [get_bd_pins proc_sys_reset_0/peripheral_aresetn] [get_bd_pins gmii_tx_blk/eth_resetn] [get_bd_pins gmii_rx_blk/m_axis_aresetn]
connect_bd_net -net reset_1 [get_bd_pins proc_sys_reset_0/peripheral_reset] [get_bd_pins gmii_tx_blk/eth_reset] [get_bd_pins gmii2axis_0/rst]
connect_bd_net [get_bd_pins ponylink_master_0/link_error] [get_bd_pins tx_link_error]
connect_bd_net [get_bd_pins xlconstant_0/dout] [get_bd_pins axi_ethernet_0/mdio_mdio_i]

current_bd_instance /axi_eth_blk_3/gmii_tx_blk
connect_bd_intf_net [get_bd_intf_pins S_AXIS] [get_bd_intf_pins eth_frame_fifo_zynq_0/axis_in]
connect_bd_intf_net [get_bd_intf_pins eth_frame_fifo_zynq_0/axis_out] [get_bd_intf_pins tx_cc/S_AXIS]
connect_bd_intf_net [get_bd_intf_pins M_AXIS] [get_bd_intf_pins tx_cc/M_AXIS]
connect_bd_net -net clk_wiz_0_clk_out4 [get_bd_pins eth_clk] [get_bd_pins tx_cc/s_axis_aclk] [get_bd_pins eth_frame_fifo_zynq_0/clk]
connect_bd_net -net proc_sys_reset_0_peripheral_aresetn [get_bd_pins eth_resetn] [get_bd_pins tx_cc/s_axis_aresetn]
connect_bd_net -net m_axis_aresetn_1 [get_bd_pins plink_aresetn] [get_bd_pins tx_cc/m_axis_aresetn]
connect_bd_net -net m_axis_aclk_1 [get_bd_pins plink_aclk] [get_bd_pins tx_cc/m_axis_aclk]
connect_bd_net [get_bd_pins eth_reset] [get_bd_pins eth_frame_fifo_zynq_0/reset]
